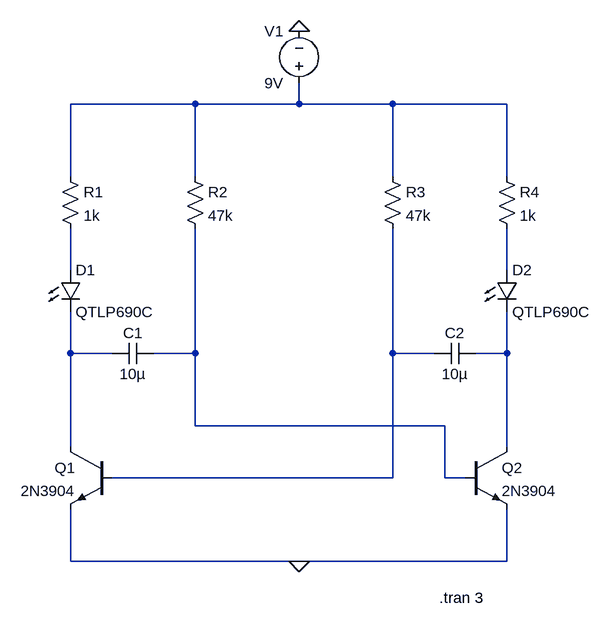
[diagram p0: schematic Astable_Multivibrator.asc]
Astable_Multivibrator.asc, the LTspice schematic file:
Version 4
SHEET 1 1184 824
WIRE 576 48 384 48
WIRE 736 48 736 16
WIRE 736 48 576 48
WIRE 880 48 736 48
WIRE 1056 48 880 48
WIRE 384 160 384 48
WIRE 576 160 576 48
WIRE 880 160 880 48
WIRE 1056 160 1056 48
WIRE 384 304 384 240
WIRE 1056 304 1056 240
WIRE 384 432 384 368
WIRE 448 432 384 432
WIRE 576 432 576 240
WIRE 576 432 512 432
WIRE 880 432 880 240
WIRE 944 432 880 432
WIRE 1056 432 1056 368
WIRE 1056 432 1008 432
WIRE 576 544 576 432
WIRE 960 544 576 544
WIRE 384 576 384 432
WIRE 1056 576 1056 432
WIRE 880 624 880 432
WIRE 880 624 448 624
WIRE 960 624 960 544
WIRE 992 624 960 624
WIRE 384 752 384 672
WIRE 736 752 384 752
WIRE 1056 752 1056 672
WIRE 1056 752 736 752
FLAG 736 752 0
FLAG 736 -64 0
SYMBOL Res 368 144 R0
SYMATTR InstName R1
SYMATTR Value 1k
SYMBOL Res 560 144 R0
SYMATTR InstName R2
SYMATTR Value 47k
SYMBOL Res 864 144 R0
SYMATTR InstName R3
SYMATTR Value 47k
SYMBOL Res 1040 144 R0
SYMATTR InstName R4
SYMATTR Value 1k
SYMBOL Cap 512 416 R90
WINDOW 0 0 32 VBottom 2
WINDOW 3 32 32 VTop 2
SYMATTR InstName C1
SYMATTR Value 10µ
SYMBOL Cap 1008 416 R90
WINDOW 0 0 32 VBottom 2
WINDOW 3 32 32 VTop 2
SYMATTR InstName C2
SYMATTR Value 10µ
SYMBOL npn 992 576 R0
SYMATTR InstName Q2
SYMATTR Value 2N3904
SYMBOL npn 448 576 M0
SYMATTR InstName Q1
SYMATTR Value 2N3904
SYMBOL LED 368 304 R0
SYMATTR InstName D1
SYMATTR Value QTLP690C
SYMBOL LED 1040 304 R0
SYMATTR InstName D2
SYMATTR Value QTLP690C
SYMBOL Voltage 736 32 R180
WINDOW 0 24 96 Left 2
WINDOW 3 24 16 Left 2
SYMATTR InstName V1
SYMATTR Value 9V
TEXT 952 808 Left 2 !.tran 3

The netlist it stands for:
* Astable_Multivibrator.asc
R1 N001 N002 1k
R2 N001 N005 47k
R3 N001 N006 47k
R4 N001 N003 1k
C1 N005 N004 10µ
C2 N007 N006 10µ
Q2 N007 N005 0 0 2N3904
Q1 N004 N006 0 0 2N3904
D1 N002 N004 QTLP690C
D2 N003 N007 QTLP690C
V1 N001 0 9V
.model D D
.lib standard.dio
.model NPN NPN
.model PNP PNP
.lib standard.bjt
.tran 3
.backanno
.end